# Altium project power_control.PrjPcb
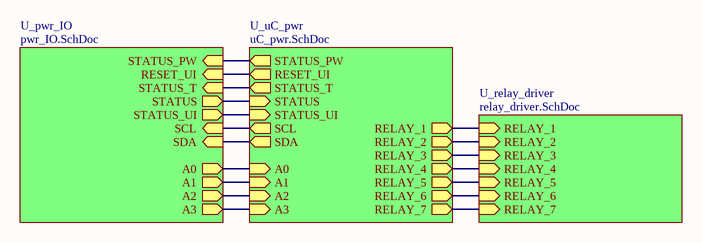
[diagram p0: top_level.SchDoc]
4 sheets, 49 parts. Net scope: hierarchical (ports join the sheet entries above them; power ports are global).
Board file: pwr_pcb.PcbDoc
Sheets:
  top_level.SchDoc
    U_pwr_IO = pwr_IO.SchDoc
    U_relay_driver = relay_driver.SchDoc
    U_uC_pwr = uC_pwr.SchDoc

## Sheet top_level.SchDoc
size A4

### Sub-sheets
U_pwr_IO = pwr_IO.SchDoc: STATUS_PW (in), STATUS_UI (out), RESET_UI (in), STATUS_T (in), STATUS (out), A2 (out), A3 (out), A0 (out), A1 (out), SCL (in), SDA (in)
U_relay_driver = relay_driver.SchDoc: RELAY_6 (in), RELAY_5 (in), RELAY_7 (in), RELAY_3 (in), RELAY_2 (in), RELAY_1 (in), RELAY_4 (in)
U_uC_pwr = uC_pwr.SchDoc: A0 (in), A1 (in), A2 (in), A3 (in), SCL (out), SDA (out), STATUS_PW (out), STATUS_UI (in), RESET_UI (out), STATUS_T (out), STATUS (in), RELAY_1 (out), RELAY_2 (out), RELAY_3 (out), RELAY_4 (out), RELAY_5 (out), RELAY_6 (out), RELAY_7 (out)

### Nets
T_pan: sheet U_pwr_IO/A3, sheet U_uC_pwr/A3
T_ui: sheet U_pwr_IO/A2, sheet U_uC_pwr/A2
NetP3_3: sheet U_pwr_IO/STATUS_T, sheet U_uC_pwr/STATUS_T
NetP3_4: sheet U_pwr_IO/RESET_UI, sheet U_uC_pwr/RESET_UI
NetP3_5: sheet U_pwr_IO/STATUS_PW, sheet U_uC_pwr/STATUS_PW
NetP6_1: sheet U_pwr_IO/STATUS, sheet U_uC_pwr/STATUS
NetP6_2: sheet U_pwr_IO/STATUS_UI, sheet U_uC_pwr/STATUS_UI
NetP7_3: sheet U_pwr_IO/SDA, sheet U_uC_pwr/SDA
NetP7_4: sheet U_pwr_IO/SCL, sheet U_uC_pwr/SCL
NetP8_1: sheet U_pwr_IO/A0, sheet U_uC_pwr/A0
NetP9_1: sheet U_pwr_IO/A1, sheet U_uC_pwr/A1
NetQ1_2: sheet U_relay_driver/RELAY_1, sheet U_uC_pwr/RELAY_1
NetQ2_2: sheet U_relay_driver/RELAY_2, sheet U_uC_pwr/RELAY_2
NetQ3_2: sheet U_relay_driver/RELAY_3, sheet U_uC_pwr/RELAY_3
NetQ4_2: sheet U_relay_driver/RELAY_4, sheet U_uC_pwr/RELAY_4
NetQ5_2: sheet U_relay_driver/RELAY_5, sheet U_uC_pwr/RELAY_5
NetQ6_2: sheet U_relay_driver/RELAY_6, sheet U_uC_pwr/RELAY_6
NetQ7_2: sheet U_relay_driver/RELAY_7, sheet U_uC_pwr/RELAY_7

## Sheet pwr_IO.SchDoc
size A4
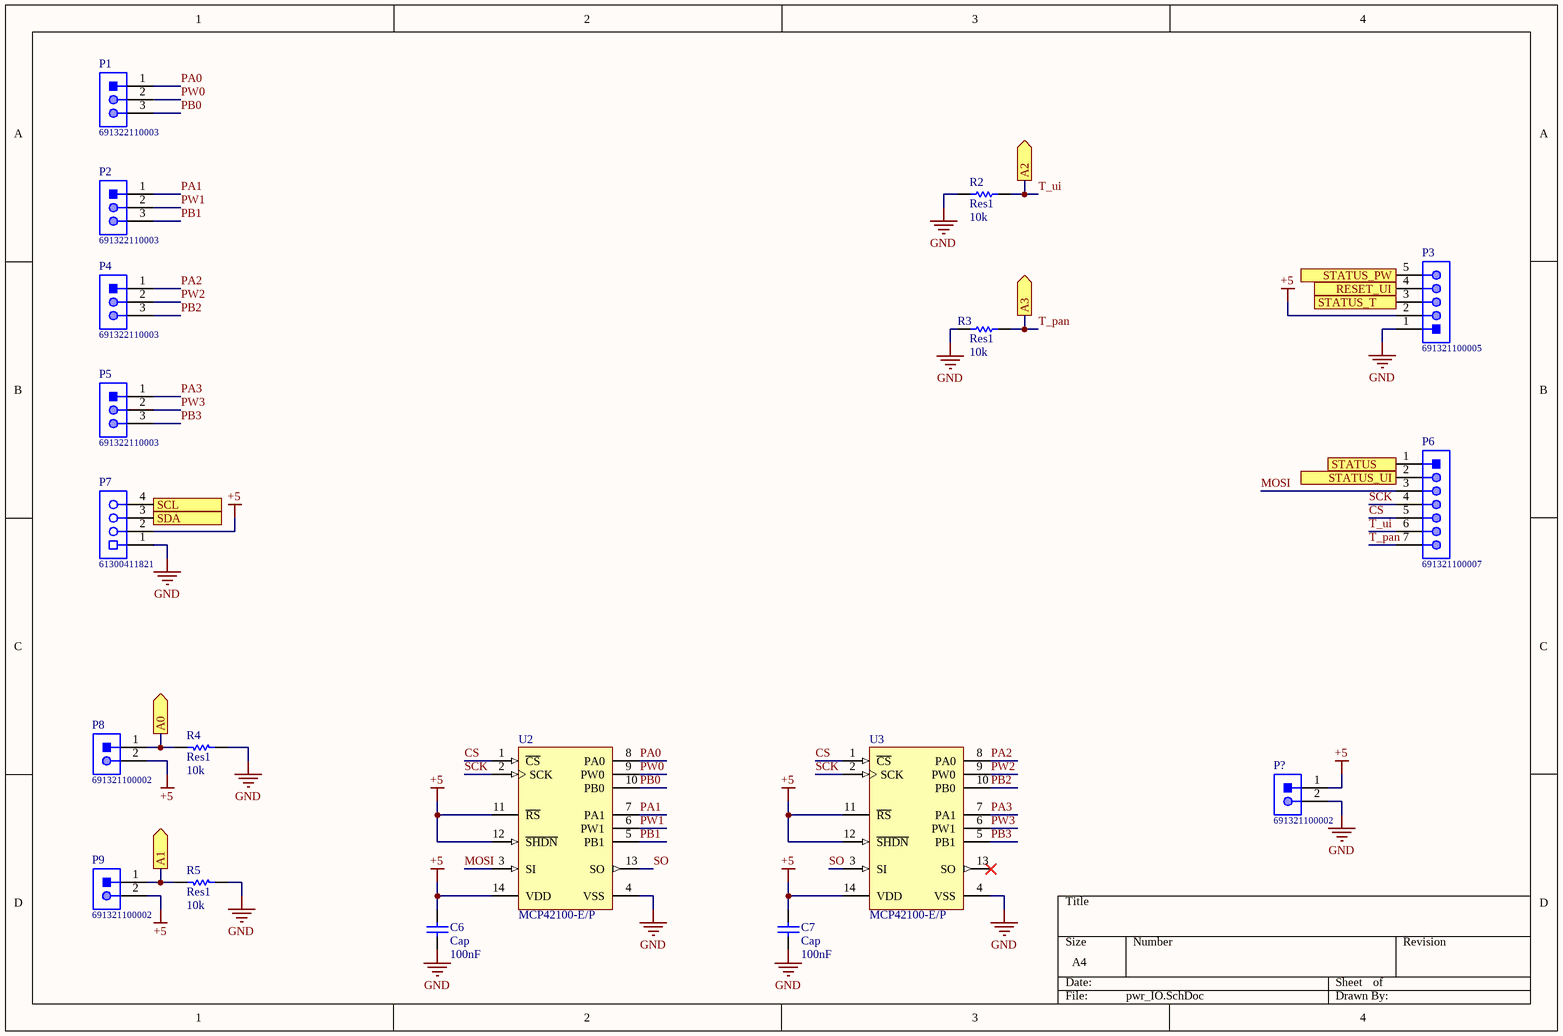
[diagram p1: pwr_IO.SchDoc]

### Parts
C6  Cap  value 100nF  [RAD-0.3]
C7  Cap  value 100nF  [RAD-0.3]
P1  691322110003  [691322110003]
P2  691322110003  [691322110003]
P3  691321100005  [691321100005]
P4  691322110003  [691322110003]
P5  691322110003  [691322110003]
P6  691321100007  [691321100007]
P7  61300411821  [61300411821]
P8  691321100002  [691321100002]
P9  691321100002  [691321100002]
P?  691321100002  [691321100002]
R2  Res1  value 10k  [AXIAL-0.3]
R3  Res1  value 10k  [AXIAL-0.3]
R4  Res1  value 10k  [AXIAL-0.3]
R5  Res1  value 10k  [AXIAL-0.3]
U2  MCP42100-E/P  [PDIP300-P14]
U3  MCP42100-E/P  [PDIP300-P14]

### Ports
A0 (out), A1 (out), A2 (out), A3 (out), RESET_UI (in), SCL (in), SDA (in), STATUS (out), STATUS_PW (in), STATUS_T (in), STATUS_UI (out)

### Nets
+5: C6.2 C7.2 P3.2 P7.2 P8.2 P9.2 P?.1 U2.11(~{RS}) U2.12(~{SHDN}) U2.14(VDD) U3.11(~{RS}) U3.12(~{SHDN}) U3.14(VDD)
GND: C6.1 C7.1 P3.1 P7.1 P?.2 R2.1 R3.1 R4.1 R5.1 U2.4(VSS) U3.4(VSS)
CS: P6.5 U2.1(~{CS}) U3.1(~{CS})
MOSI: P6.3 U2.3(SI)
PA0: P1.1 U2.8(PA0)
PA1: P2.1 U2.7(PA1)
PA2: P4.1 U3.8(PA0)
PA3: P5.1 U3.7(PA1)
PB0: P1.3 U2.10(PB0)
PB1: P2.3 U2.5(PB1)
PB2: P4.3 U3.10(PB0)
PB3: P5.3 U3.5(PB1)
PW0: P1.2 U2.9(PW0)
PW1: P2.2 U2.6(PW1)
PW2: P4.2 U3.9(PW0)
PW3: P5.2 U3.6(PW1)
SCK: P6.4 U2.2(SCK) U3.2(SCK)
SO: U2.13(SO) U3.3(SI)
T_pan: P6.7 R3.2 ; port A3
T_ui: P6.6 R2.2 ; port A2
NetP3_3: P3.3 ; port STATUS_T
NetP3_4: P3.4 ; port RESET_UI
NetP3_5: P3.5 ; port STATUS_PW
NetP6_1: P6.1 ; port STATUS
NetP6_2: P6.2 ; port STATUS_UI
NetP7_3: P7.3 ; port SDA
NetP7_4: P7.4 ; port SCL
NetP8_1: P8.1 R4.2 ; port A0
NetP9_1: P9.1 R5.2 ; port A1

Not connected (* = marked no-connect by the designer): U3 13(SO)*

### Library data of the parts
C6 C7 = Cap: Capacitor; Published: 8-Jun-2000; LatestRevisionDate: 17-Jul-2002; LatestRevisionNote: Re-released for DXP Platform.; PackageReference: RAD-0.3; Publisher: Altium Limited; PackageDescription: Radial Cap, Thru-Hole; 2 Leads; 0.3 in Pin Spacing
P1 P2 P4 P5 = CMP-1502-01792-1: Serie 3221 - 3.50mm Horizontal PCB Header WR-TBL, 3 pin; Manufacturer: Wurth Elektronik; Pin Number: 3; Gender: Male; Part Number: 691322110003; Pitch: 3.50mm; Manufacturer URL: http://www.we-online.de; Packaging: Box; Operating Temperature: -40to105degC; Datasheet URL: http://katalog.we-online.de/em/datasheet/6913221100xx.pdf; Publisher: WurthElektronik; Mounting Technology: THT; Package Reference: 691322110003
P3 = CMP-1502-01786-1: Serie 3211 - 3.50mm Vertical PCB Header WR-TBL, 5 pin; Manufacturer: Wurth Elektronik; Pin Number: 5; Gender: Male; Datasheet URL: http://katalog.we-online.de/em/datasheet/6913211000xx.pdf; Package Reference: 691321100005; Manufacturer URL: http://www.we-online.de; Pitch: 3.50mm; Operating Temperature: -40to105degC; Publisher: WurthElektronik; Packaging: Box; Part Number: 691321100005; Mounting Technology: THT
P6 = CMP-1502-01788-1: Serie 3211 - 3.50mm Vertical PCB Header WR-TBL, 7 pin; Manufacturer: Wurth Elektronik; Gender: Male; Pin Number: 7; Manufacturer URL: http://www.we-online.de; Package Reference: 691321100007; Part Number: 691321100007; Packaging: Box; Publisher: WurthElektronik; Operating Temperature: -40to105degC; Pitch: 3.50mm; Mounting Technology: THT; Datasheet URL: http://katalog.we-online.de/em/datasheet/6913211000xx.pdf
P7 = CMP-1502-01316-1: THT Vertical Socket Header WR-PHD, Pitch 2.54 mm, Single Row, 4 pins; Manufacturer: Wurth Elektronik; Working Voltage: 250VAC; Rated Current: 3A; Pin Number: 4; Withstanding Voltage: 500VAC; Contact Resistance: 20mOhm; Gender: Female; Pitch: 2.54mm; Datasheet URL: https://katalog.we-online.de/em/datasheet/6130xx11821.pdf; Part Number: 61300411821; Operating Temperature: -40to125degC; Row Number: Single; Package Reference: 61300411821; Orientation: Vertical; Publisher: WurthElektronik; Packaging: Tray; Manufacturer URL: http://www.we-online.de; Mounting Technology: THT
P8 P9 P? = CMP-1502-01783-1: Serie 3211 - 3.50mm Vertical PCB Header WR-TBL, 2 pin; Manufacturer: Wurth Elektronik; Gender: Male; Pin Number: 2; Part Number: 691321100002; Mounting Technology: THT; Manufacturer URL: http://www.we-online.de; Datasheet URL: http://katalog.we-online.de/em/datasheet/6913211000xx.pdf; Packaging: Box; Package Reference: 691321100002; Publisher: WurthElektronik; Pitch: 3.50mm; Operating Temperature: -40to105degC
R2-R5 = Res1: Resistor; Published: 8-Jun-2000; LatestRevisionDate: 17-Jul-2002; LatestRevisionNote: Re-released for DXP Platform.; PackageReference: AXIAL-0.3; Publisher: Altium Limited; PackageDescription: Axial Device, Thru-Hole; 2 Leads; 0.3 in Pin Spacing
U2 U3 = CMP-0188-00236-2: Single/Dual Digital Potentiometer with SPI Interface, 14-Pin PDIP, Extended Temperature; ComponentLink2Description: Datasheet; ComponentLink1URL: http://www.microchip.com/; ComponentLink3URL: http://www.microchip.com/stellent/groups/techpub_sg/documents/packagingspec/en012702.pdf; DatasheetVersion: Jul-2003; ComponentLink3Description: Package Specification; ComponentLink1Description: Manufacturer URL; PackageDescription: 14-Lead Plastic Dual In-Line (P) - 300 mil Body [PDIP]; PackageReference: PDIP300-P14; PackageVersion: revBB, Aug-2009; RevisionNote: URLs added.; ComponentLink2URL: http://ww1.microchip.com/downloads/en/DeviceDoc/11195c.pdf

## Sheet relay_driver.SchDoc
size A4
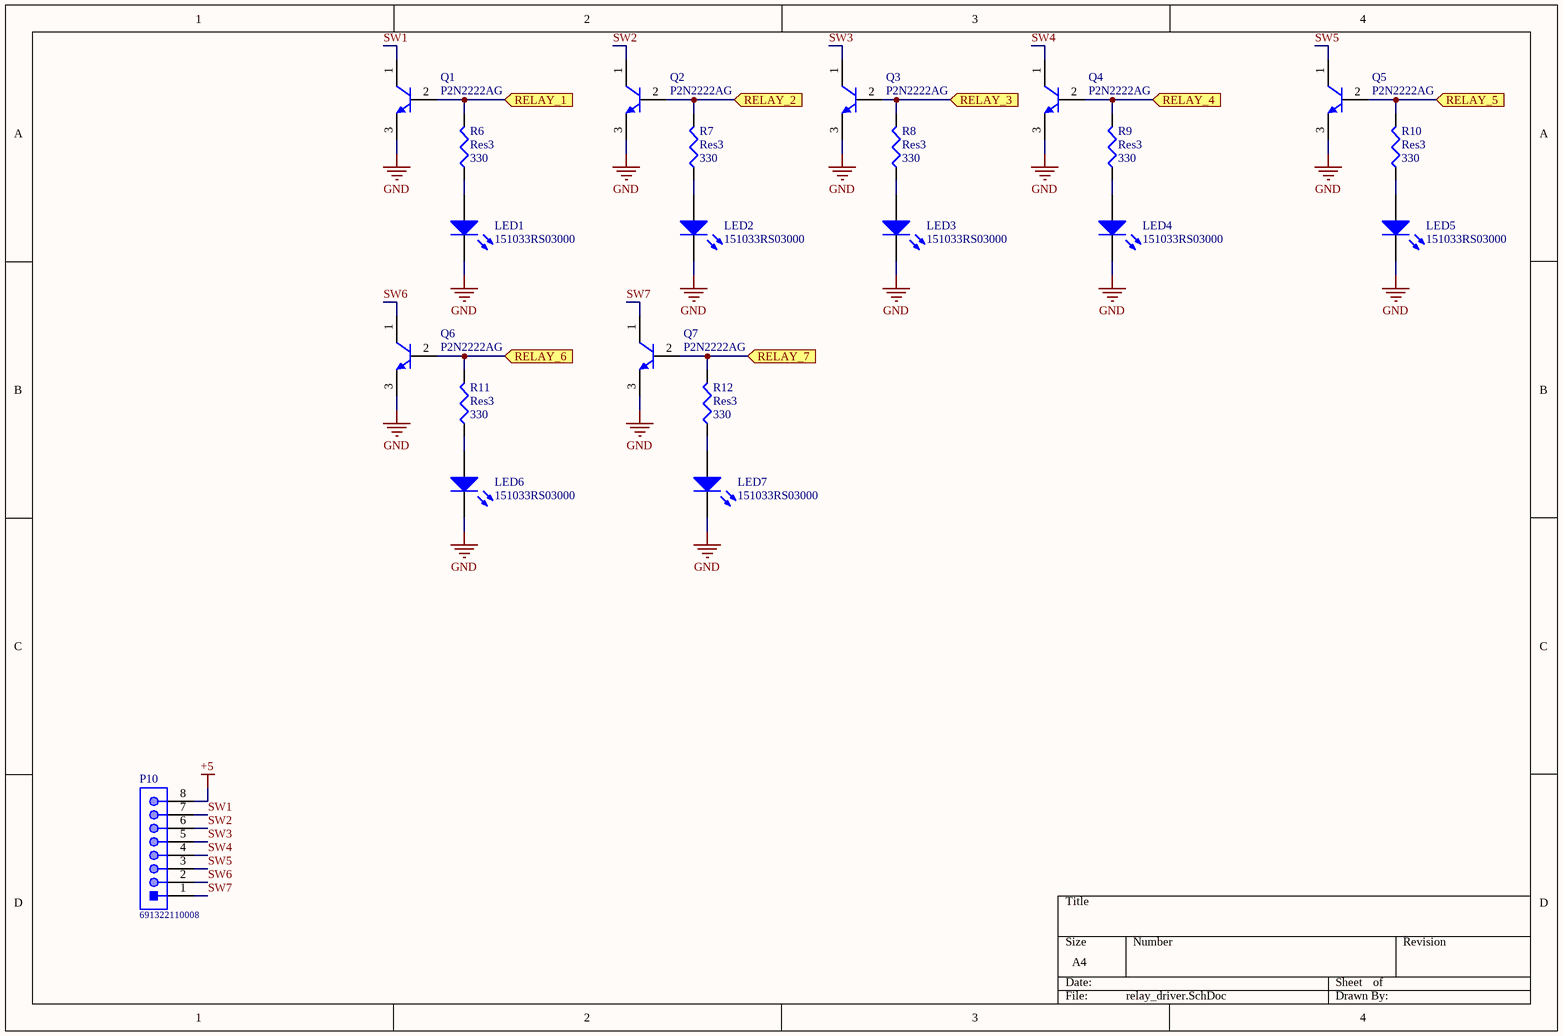
[diagram p2: relay_driver.SchDoc]

### Parts
LED1  151033RS03000  [Type 3mm]
LED2  151033RS03000  [Type 3mm]
LED3  151033RS03000  [Type 3mm]
LED4  151033RS03000  [Type 3mm]
LED5  151033RS03000  [Type 3mm]
LED6  151033RS03000  [Type 3mm]
LED7  151033RS03000  [Type 3mm]
P10  691322110008  [691322110008]
Q1  P2N2222AG  [ONSC-TO-92-3-29-11]
Q2  P2N2222AG  [ONSC-TO-92-3-29-11]
Q3  P2N2222AG  [ONSC-TO-92-3-29-11]
Q4  P2N2222AG  [ONSC-TO-92-3-29-11]
Q5  P2N2222AG  [ONSC-TO-92-3-29-11]
Q6  P2N2222AG  [ONSC-TO-92-3-29-11]
Q7  P2N2222AG  [ONSC-TO-92-3-29-11]
R6  Res3  value 330  [AXIAL-0.3]
R7  Res3  value 330  [AXIAL-0.3]
R8  Res3  value 330  [AXIAL-0.3]
R9  Res3  value 330  [AXIAL-0.3]
R10  Res3  value 330  [AXIAL-0.3]
R11  Res3  value 330  [AXIAL-0.3]
R12  Res3  value 330  [AXIAL-0.3]

### Ports
RELAY_1 (in), RELAY_2 (in), RELAY_3 (in), RELAY_4 (in), RELAY_5 (in), RELAY_6 (in), RELAY_7 (in)

### Nets
+5: P10.8
GND: LED1.1(K) LED2.1(K) LED3.1(K) LED4.1(K) LED5.1(K) LED6.1(K) LED7.1(K) Q1.3(E) Q2.3(E) Q3.3(E) Q4.3(E) Q5.3(E) Q6.3(E) Q7.3(E)
SW1: P10.7 Q1.1(C)
SW2: P10.6 Q2.1(C)
SW3: P10.5 Q3.1(C)
SW4: P10.4 Q4.1(C)
SW5: P10.3 Q5.1(C)
SW6: P10.2 Q6.1(C)
SW7: P10.1 Q7.1(C)
NetLED1_2: LED1.2(A) R6.1
NetLED2_2: LED2.2(A) R7.1
NetLED3_2: LED3.2(A) R8.1
NetLED4_2: LED4.2(A) R9.1
NetLED5_2: LED5.2(A) R10.1
NetLED6_2: LED6.2(A) R11.1
NetLED7_2: LED7.2(A) R12.1
NetQ1_2: Q1.2(B) R6.2 ; port RELAY_1
NetQ2_2: Q2.2(B) R7.2 ; port RELAY_2
NetQ3_2: Q3.2(B) R8.2 ; port RELAY_3
NetQ4_2: Q4.2(B) R9.2 ; port RELAY_4
NetQ5_2: Q5.2(B) R10.2 ; port RELAY_5
NetQ6_2: Q6.2(B) R11.2 ; port RELAY_6
NetQ7_2: Q7.2(B) R12.2 ; port RELAY_7

### Library data of the parts
LED1-LED7 = CMP-1489-00004-1: THT LED round mono-color waterclear, WL-TMRW, Red; Manufacturer: Wuerth Elektronik; ComponentLink1URL: http://www.we-online.com; PartNumber: 151033RS03000; ComponentLink1Description: Manufacturer URL; PackageReference: Type 3mm; ComponentLink2Description: Datasheet; Emitting color: Red; ComponentLink2URL: http://katalog.we-online.de/pbs/datasheet/7448042001.pdfhttp://katalog.we-online.de/pbs/datasheet/7448042001.pdfhttp://katalog.we-online.de/pbs/datasheet/7448042001.pdfhttp://katalog.we-online.de/pbs/datasheet/151033RS03000.pdf
P10 = CMP-1502-01797-1: Serie 3221 - 3.50mm Horizontal PCB Header WR-TBL, 8 pin; Manufacturer: Wurth Elektronik; Pin Number: 8; Gender: Male; Packaging: Box; Publisher: WurthElektronik; Pitch: 3.50mm; Mounting Technology: THT; Datasheet URL: http://katalog.we-online.de/em/datasheet/6913221100xx.pdf; Operating Temperature: -40to105degC; Manufacturer URL: http://www.we-online.de; Package Reference: 691322110008; Part Number: 691322110008
Q1-Q7 = CMP-1048-01402-1: Amplifier Transistor, NPN Silicon, 3-Pin TO-92, Pb-Free, Bulk Box; Manufacturer: On Semiconductor; IC Continuous (A): 0.6; fT Min (MHz): 300; ComponentLink2Description: Datasheet; ComponentLink1Description: Manufacturer URL; ComponentLink2URL: http://www.onsemi.com/pub_link/Collateral/P2N2222A-D.PDF; ComponentLink3Description: Package Specification; RoHS: TRUE; ComponentLink1URL: http://www.onsemi.com/; PartNumber: P2N2222AG; Mounting Technology: Through Hole; PackageReference: TO-92-3-29-11_AM_SL; Polarity: NPN; Packing: Bulk Box; DatasheetVersion: Rev. 7; PackageDescription: 3-Pin Transistor Outline, Body 4.825 x 3.685 mm, Pitch 1.27 mm; PackageVersion: Rev. AM; ComponentLink3URL: http://www.onsemi.cn/pub_link/Collateral/2N6426-D.PDF
R6-R12 = Res3: Resistor; Published: 8-Jun-2000; LatestRevisionDate: 29-May-2009; LatestRevisionNote: IPC-7351 Footprint Added.; PackageReference: J1-0603; Publisher: Altium Limited; PackageDescription: Chip Resistor

## Sheet uC_pwr.SchDoc
size A4
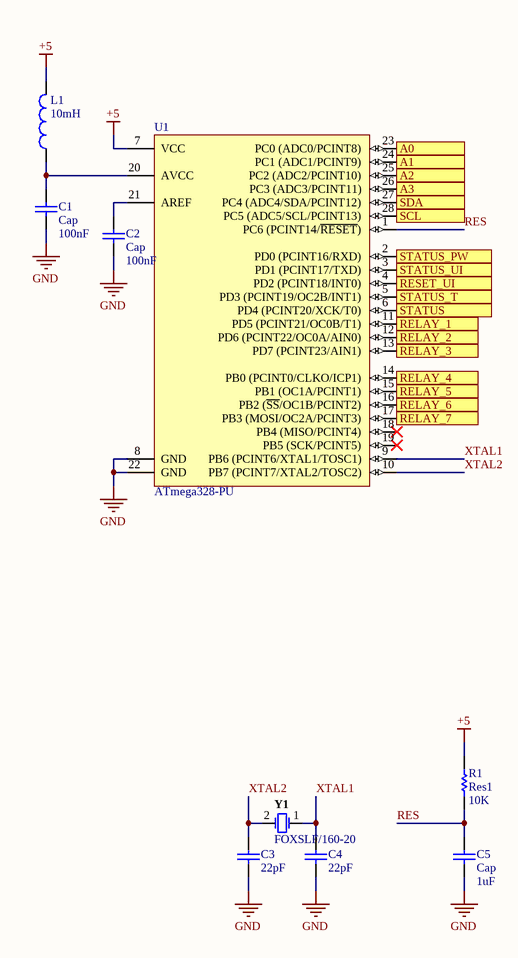
[diagram p3: uC_pwr.SchDoc]

### Parts
C1  Cap  value 100nF  [RAD-0.3]
C2  Cap  value 100nF  [RAD-0.3]
C3  value 22pF  [RAD-0.3]  (hidden comment: Cap)
C4  value 22pF  [RAD-0.3]  (hidden comment: Cap)
C5  Cap  value 1uF  [RAD-0.3]
L1  10mH  [INDR62-500-1100X850X1100]
R1  Res1  value 10K  [AXIAL-0.3]
U1  ATmega328-PU  [28P3]
Y1  FOXSLF/160-20  [FOX-FOXSLF160-20]

### Ports
A0 (in), A1 (in), A2 (in), A3 (in), RELAY_1 (out), RELAY_2 (out), RELAY_3 (out), RELAY_4 (out), RELAY_5 (out), RELAY_6 (out), RELAY_7 (out), RESET_UI (out), SCL (out), SDA (out), STATUS (in), STATUS_PW (out), STATUS_T (out), STATUS_UI (in)

### Nets
+5: L1.2 R1.2 U1.7(VCC)
GND: C1.1 C2.1 C3.1 C4.1 C5.1 U1.8(GND) U1.22(GND)
RES: C5.2 R1.1 U1.1(PC6_(PCINT14/~{RESET}))
T_pan: U1.26(PC3_(ADC3/PCINT11)) ; port A3
T_ui: U1.25(PC2_(ADC2/PCINT10)) ; port A2
XTAL1: C4.2 U1.9(PB6_(PCINT6/XTAL1/TOSC1)) Y1.1
XTAL2: C3.2 U1.10(PB7_(PCINT7/XTAL2/TOSC2)) Y1.2
NetC1_2: C1.2 L1.1 U1.20(AVCC)
NetC2_2: C2.2 U1.21(AREF)
NetP3_3: U1.5(PD3_(PCINT19/OC2B/INT1)) ; port STATUS_T
NetP3_4: U1.4(PD2_(PCINT18/INT0)) ; port RESET_UI
NetP3_5: U1.2(PD0_(PCINT16/RXD)) ; port STATUS_PW
NetP6_1: U1.6(PD4_(PCINT20/XCK/T0)) ; port STATUS
NetP6_2: U1.3(PD1_(PCINT17/TXD)) ; port STATUS_UI
NetP7_3: U1.27(PC4_(ADC4/SDA/PCINT12)) ; port SDA
NetP7_4: U1.28(PC5_(ADC5/SCL/PCINT13)) ; port SCL
NetP8_1: U1.23(PC0_(ADC0/PCINT8)) ; port A0
NetP9_1: U1.24(PC1_(ADC1/PCINT9)) ; port A1
NetQ1_2: U1.11(PD5_(PCINT21/OC0B/T1)) ; port RELAY_1
NetQ2_2: U1.12(PD6_(PCINT22/OC0A/AIN0)) ; port RELAY_2
NetQ3_2: U1.13(PD7_(PCINT23/AIN1)) ; port RELAY_3
NetQ4_2: U1.14(PB0_(PCINT0/CLKO/ICP1)) ; port RELAY_4
NetQ5_2: U1.15(PB1_(OC1A/PCINT1)) ; port RELAY_5
NetQ6_2: U1.16(PB2_(~{SS}/OC1B/PCINT2)) ; port RELAY_6
NetQ7_2: U1.17(PB3_(MOSI/OC2A/PCINT3)) ; port RELAY_7

Not connected (* = marked no-connect by the designer): U1 18(PB4_(MISO/PCINT4))* 19(PB5_(SCK/PCINT5))*

### Library data of the parts
C1-C5 = Cap: Capacitor; Published: 8-Jun-2000; LatestRevisionDate: 17-Jul-2002; LatestRevisionNote: Re-released for DXP Platform.; PackageReference: RAD-0.3; Publisher: Altium Limited; PackageDescription: Radial Cap, Thru-Hole; 2 Leads; 0.3 in Pin Spacing
L1 = CMP-1747-00016-1: Radial Inductor, 10 uH, +/- 10%, 3 A, -55 to 105 degC, 2-Pin THD, RoHS, Bulk; Outputs: 4; Case\Package: DIP; Output Voltage: 36 V; Interface: Parallel; Min Supply Voltage: 4.5 V; Output Current: 600 mA; Max Operating Temperature: 70 degC; PackageDescription: 2-Pin Radial Lead, Dia 8.5 mm, Pitch 5 mm; Min Operating Temperature: 0 degC; ComponentLink2Description: Datasheet; Mount: Through Hole; PackageReference: INDR62-500-1100X850X1100; REACH SVHC: No SVHC; Width: 0.25 inch; Package Quantity: 25; ComponentLink1Description: Manufacturer URL; Height: 0.25 inch; DatasheetVersion: Aug-10; Packaging: Rail/Tube; Length: 0.75 inch; Max Supply Voltage: 36 V; RoHSCompliant: true; ComponentLink1URL: http://www.bourns.com/; Radiation Hardening: No; Weight: 0.03357 oz; Pins: 16; ComponentLink2URL: http://www.bourns.com/docs/Product-Datasheets/rl622_series.pdf
R1 = Res1: Resistor; Published: 8-Jun-2000; LatestRevisionDate: 17-Jul-2002; LatestRevisionNote: Re-released for DXP Platform.; PackageReference: AXIAL-0.3; Publisher: Altium Limited; PackageDescription: Axial Device, Thru-Hole; 2 Leads; 0.3 in Pin Spacing
U1 = CMP-0095-00015-2: 8-bit AVR Microcontroller, 32KB Flash, 1KB EEPROM, 2KB SRAM, 28-pin PDIP, Industrial Grade (-40°C to 85°C); ComponentLink3Description: ATmega48A/48PA/88A/88PA/168A/168PA/328/328P Summary; RevisionNote: DatasheetVersion updated. URLs added.; DatasheetVersion: revD, May-2011; ComponentLink1URL: http://www.atmel.com/; PackageVersion: revB, Sep-2001; PackageDescription: 28-lead (0.300"/7.62mm Wide) Plastic Dual Inline Package (PDIP); PackageReference: 28P3; ComponentLink1Description: Manufacturer URL; ComponentLink2Description: ATmega48A/48PA/88A/88PA/168A/168PA/328/328P Datasheet; ComponentLink3URL: http://www.atmel.com/dyn/resources/prod_documents/8271S.pdf; ComponentLink2URL: http://www.atmel.com/dyn/resources/prod_documents/8271.pdf
Y1 = CMP-1749-00003-1: Resistance Weld Thru-Hole Crystal, 16 MHz, -20 to 70 degC, 2-Pin THD, RoHS, Bulk; Voltage Rating: 250 V; Tolerance: 1%; Resistance: 221 kohm; Case\Package: Axial; Power Rating: 250 mW; RoHSCompliant: true; Package Quantity: 200; Packaging: Bulk; Min Operating Temperature: -55 degC; DatasheetVersion: Mar-15; ComponentLink1URL: http://www.foxonline.com/; Max Operating Temperature: 155 degC; PackageReference: FOXSLF160-20; Mount: Through Hole; PackageDescription: 2-Pin Through Hole Device, Body 11.35 x 4.65 mm; ComponentLink1Description: Manufacturer URL; ComponentLink2URL: http://www.foxonline.com/pdfs/hc49slf.pdf; ComponentLink2Description: Datasheet; Length: 0.248 inch

## Nets that join several sheets
+5: pwr_IO (13 pins), relay_driver (P10.8), uC_pwr (L1.2 R1.2 U1.7)
GND: pwr_IO (11 pins), relay_driver (14 pins), uC_pwr (7 pins)
NetP3_3: pwr_IO (P3.3), uC_pwr (U1.5)
NetP3_4: pwr_IO (P3.4), uC_pwr (U1.4)
NetP3_5: pwr_IO (P3.5), uC_pwr (U1.2)
NetP6_1: pwr_IO (P6.1), uC_pwr (U1.6)
NetP6_2: pwr_IO (P6.2), uC_pwr (U1.3)
NetP7_3: pwr_IO (P7.3), uC_pwr (U1.27)
NetP7_4: pwr_IO (P7.4), uC_pwr (U1.28)
NetP8_1: pwr_IO (P8.1 R4.2), uC_pwr (U1.23)
NetP9_1: pwr_IO (P9.1 R5.2), uC_pwr (U1.24)
NetQ1_2: relay_driver (Q1.2 R6.2), uC_pwr (U1.11)
NetQ2_2: relay_driver (Q2.2 R7.2), uC_pwr (U1.12)
NetQ3_2: relay_driver (Q3.2 R8.2), uC_pwr (U1.13)
NetQ4_2: relay_driver (Q4.2 R9.2), uC_pwr (U1.14)
NetQ5_2: relay_driver (Q5.2 R10.2), uC_pwr (U1.15)
NetQ6_2: relay_driver (Q6.2 R11.2), uC_pwr (U1.16)
NetQ7_2: relay_driver (Q7.2 R12.2), uC_pwr (U1.17)
T_pan: pwr_IO (P6.7 R3.2), uC_pwr (U1.26)
T_ui: pwr_IO (P6.6 R2.2), uC_pwr (U1.25)